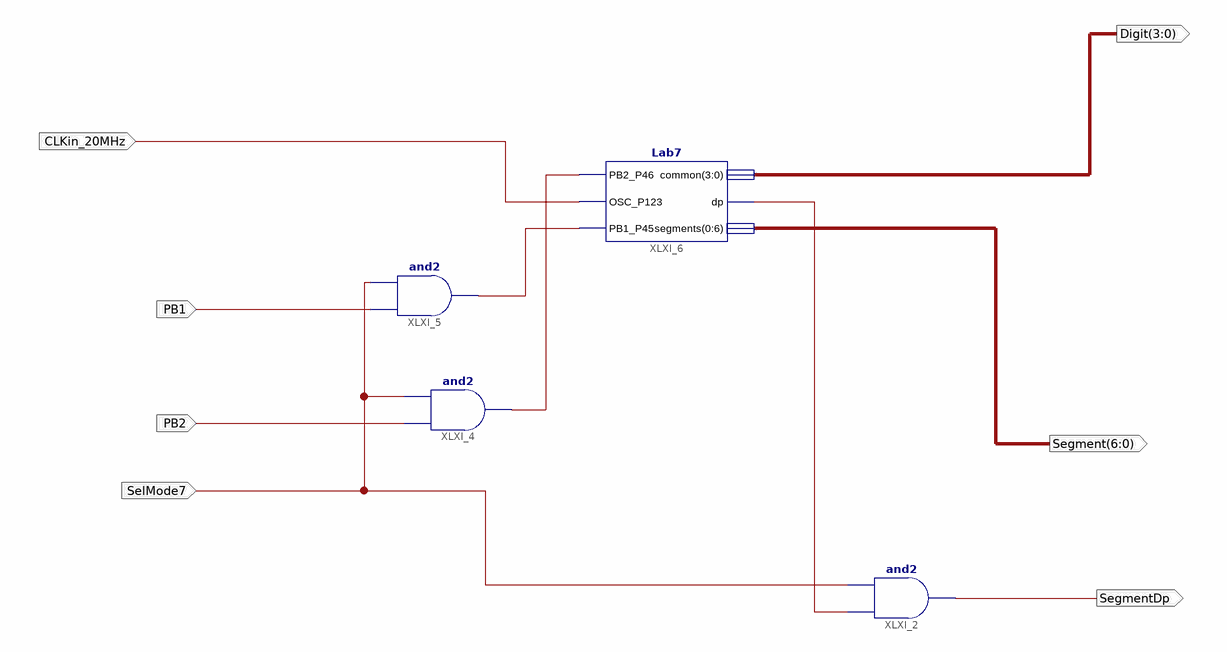
[diagram p0: schematic sheet 1]
// Xilinx ISE schematic moduleLab07.sch (spartan6) as structural Verilog: 4 symbols, 7 ports
module moduleLab07 (
  input  PB2,
  input  SelMode7,
  input  PB1,
  input  CLKin_20MHz,
  output SegmentDp,
  output [3:0] Digit,
  output [6:0] Segment
);

  wire XLXN_6, XLXN_115, XLXN_116;

  and XLXI_2 (SegmentDp, XLXN_6, SelMode7);
  and XLXI_4 (XLXN_116, PB2, SelMode7);
  and XLXI_5 (XLXN_115, PB1, SelMode7);
  Lab7 XLXI_6 (
    .PB2_P46(XLXN_116), .OSC_P123(CLKin_20MHz), .PB1_P45(XLXN_115), .common(Digit), .dp(XLXN_6),
    .segments(Segment));
endmodule
